# Altium schematic sheet Sig_Acq.SchDoc
size 457 x 254 mm; SPICEModelCacheCRLRCMOW: <root> / <DocumentId>CRLRCMOW</DocumentId> / <CacheFrame Number="0"> / <Model Name="cap" Kind="MDL"> / <Text>*Default semiconductor capacitor / .MODEL CAP C()</Text> / </Model> / </CacheFrame> / </root>
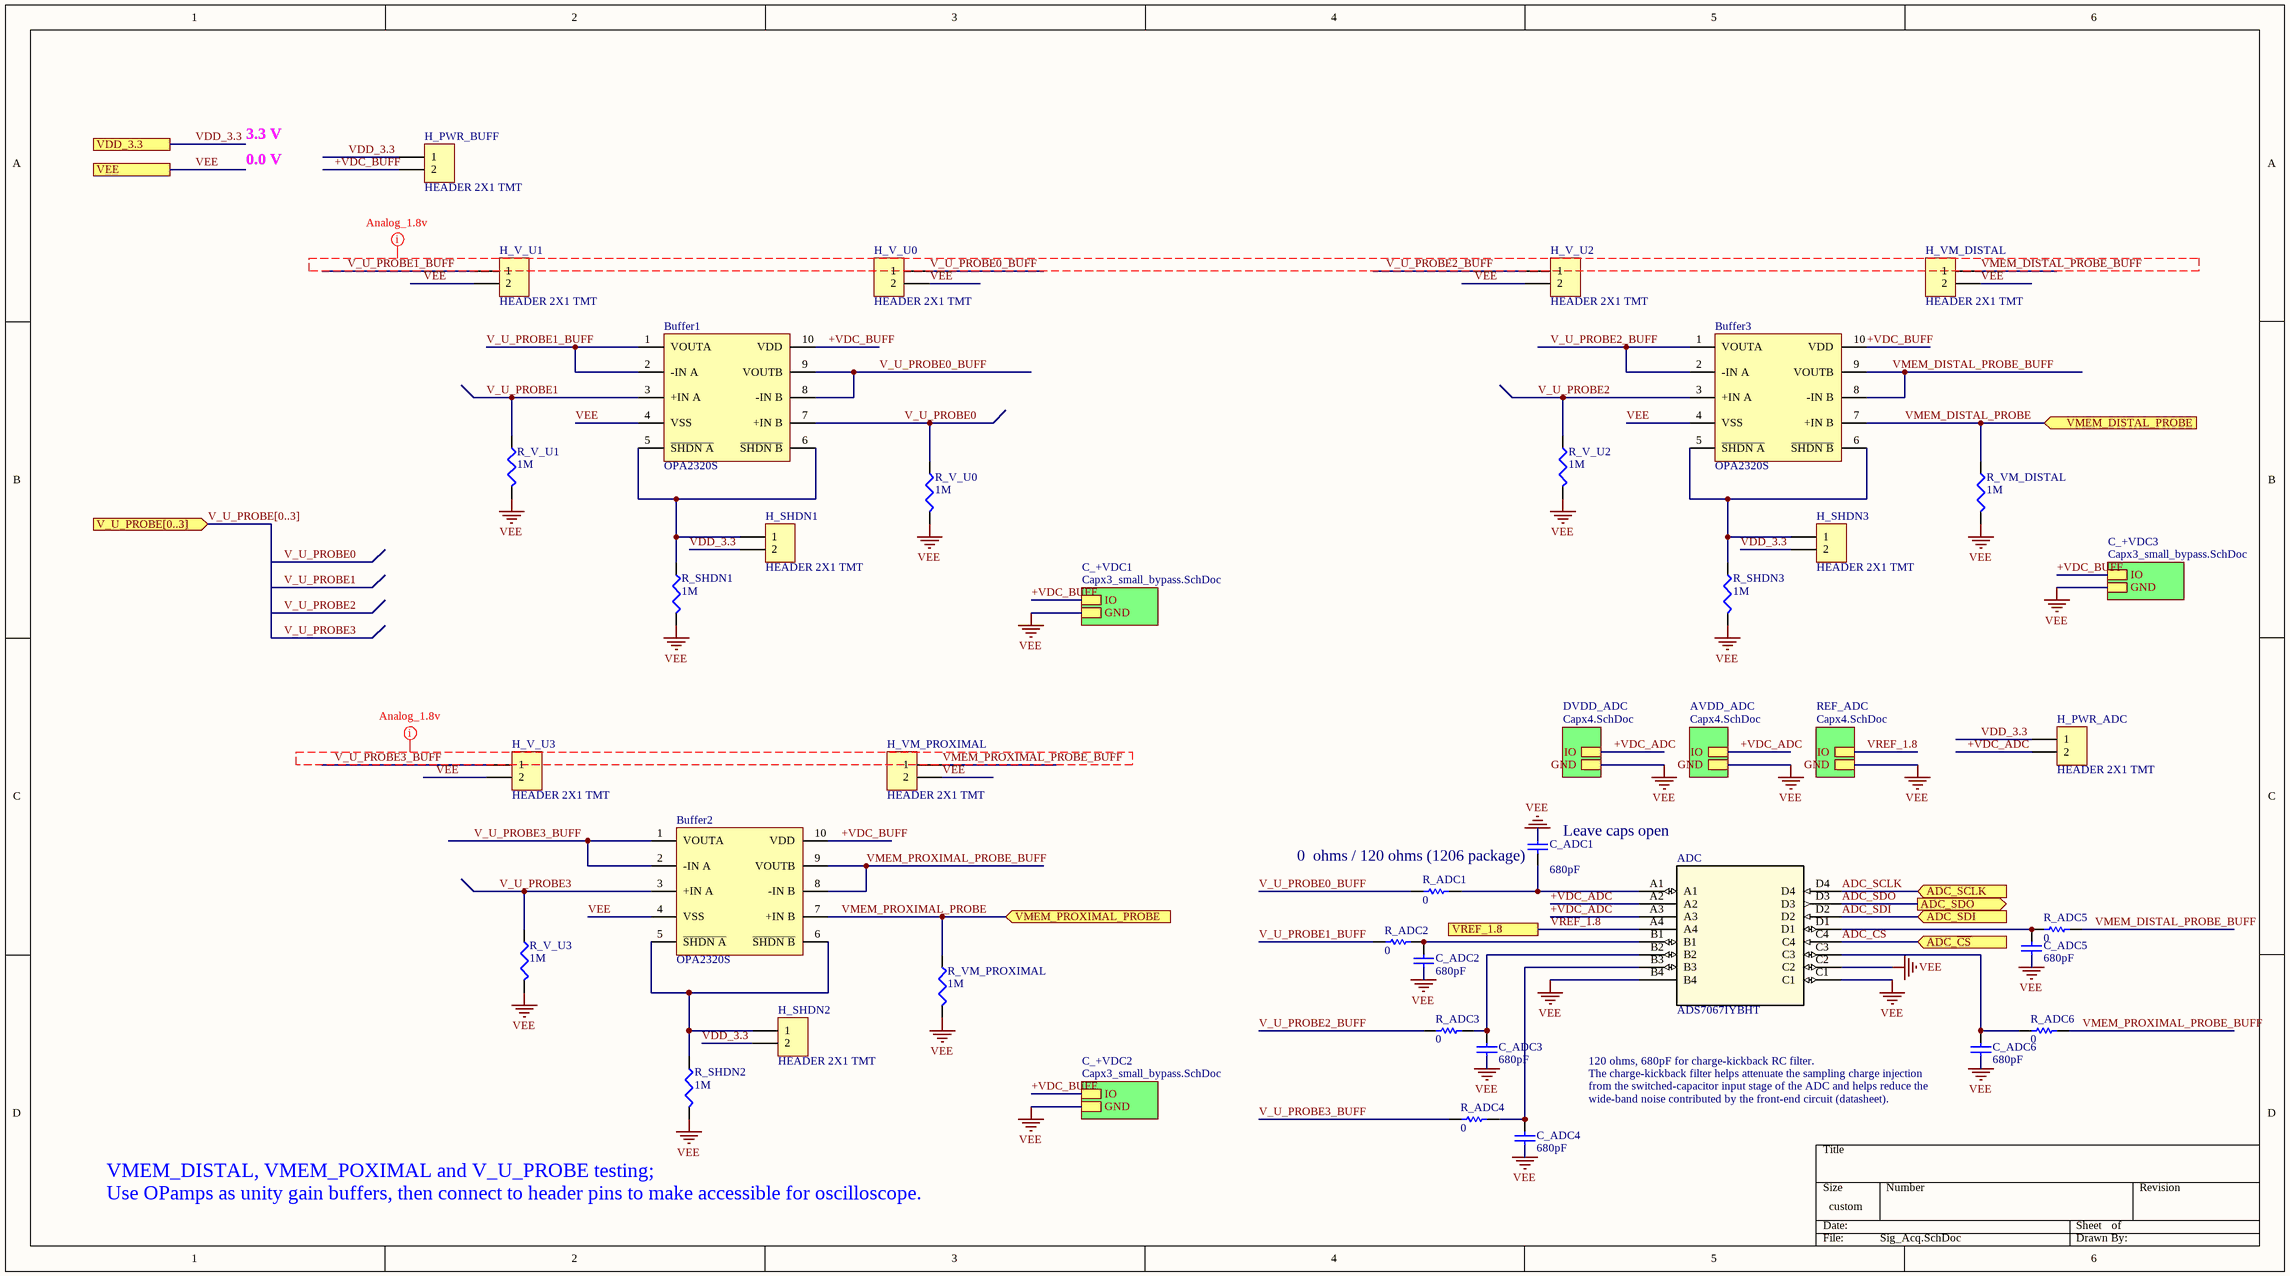
[diagram p0: Sig_Acq.SchDoc]

## Parts
ADC  ADS7067IYBHT  [BGA16_YBH_TEX]
Buffer1  OPA2320S  [TI OPA2320SAIDGSR]
Buffer2  OPA2320S  [TI OPA2320SAIDGSR]
Buffer3  OPA2320S  [TI OPA2320SAIDGSR]
C_ADC1  value 680pF  [THERM_NCP18XH103F03RB]  (hidden comment: Cap)
C_ADC2  value 680pF  [THERM_NCP18XH103F03RB]  (hidden comment: Cap)
C_ADC3  value 680pF  [THERM_NCP18XH103F03RB]  (hidden comment: Cap)
C_ADC4  value 680pF  [THERM_NCP18XH103F03RB]  (hidden comment: Cap)
C_ADC5  value 680pF  [THERM_NCP18XH103F03RB]  (hidden comment: Cap)
C_ADC6  value 680pF  [THERM_NCP18XH103F03RB]  (hidden comment: Cap)
H_PWR_ADC  HEADER 2X1 TMT  [Samtec TSW-102-07-G-S]
H_PWR_BUFF  HEADER 2X1 TMT  [Samtec TSW-102-07-G-S]
H_SHDN1  HEADER 2X1 TMT  [Samtec TSW-102-07-G-S]
H_SHDN2  HEADER 2X1 TMT  [Samtec TSW-102-07-G-S]
H_SHDN3  HEADER 2X1 TMT  [Samtec TSW-102-07-G-S]
H_V_U0  HEADER 2X1 TMT  [Samtec TSW-102-07-G-S]
H_V_U1  HEADER 2X1 TMT  [Samtec TSW-102-07-G-S]
H_V_U2  HEADER 2X1 TMT  [Samtec TSW-102-07-G-S]
H_V_U3  HEADER 2X1 TMT  [Samtec TSW-102-07-G-S]
H_VM_DISTAL  HEADER 2X1 TMT  [Samtec TSW-102-07-G-S]
H_VM_PROXIMAL  HEADER 2X1 TMT  [Samtec TSW-102-07-G-S]
R_ADC1  0  [RESC3216X70X50NL05T20]
R_ADC2  0  [RESC3216X70X50NL05T20]
R_ADC3  0  [RESC3216X70X50NL05T20]
R_ADC4  0  [RESC3216X70X50NL05T20]
R_ADC5  0  [RESC3216X70X50NL05T20]
R_ADC6  0  [RESC3216X70X50NL05T20]
R_SHDN1  value 1M  [Panasonic ERA-6A Series Resistor]  (hidden comment: Res 1M 0.1% 0805)
R_SHDN2  value 1M  [Panasonic ERA-6A Series Resistor]  (hidden comment: Res 1M 0.1% 0805)
R_SHDN3  value 1M  [Panasonic ERA-6A Series Resistor]  (hidden comment: Res 1M 0.1% 0805)
R_V_U0  value 1M  [Panasonic ERA-6A Series Resistor]  (hidden comment: Res 1M 0.1% 0805)
R_V_U1  value 1M  [Panasonic ERA-6A Series Resistor]  (hidden comment: Res 1M 0.1% 0805)
R_V_U2  value 1M  [Panasonic ERA-6A Series Resistor]  (hidden comment: Res 1M 0.1% 0805)
R_V_U3  value 1M  [Panasonic ERA-6A Series Resistor]  (hidden comment: Res 1M 0.1% 0805)
R_VM_DISTAL  value 1M  [Panasonic ERA-6A Series Resistor]  (hidden comment: Res 1M 0.1% 0805)
R_VM_PROXIMAL  value 1M  [Panasonic ERA-6A Series Resistor]  (hidden comment: Res 1M 0.1% 0805)

## Sub-sheets
AVDD_ADC = Capx4.SchDoc: IO, GND
C_+VDC1 = Capx3_small_bypass.SchDoc: IO, GND
C_+VDC2 = Capx3_small_bypass.SchDoc: IO, GND
C_+VDC3 = Capx3_small_bypass.SchDoc: IO, GND
DVDD_ADC = Capx4.SchDoc: IO, GND
REF_ADC = Capx4.SchDoc: IO, GND

## Ports
ADC_SCLK (in), ADC_SDI (in), ADC_SDO (out), ADC_~{CS} (in), V_U_PROBE[0..3] (in), VDD_3.3, VEE, VMEM_DISTAL_PROBE (in), VMEM_PROXIMAL_PROBE (in), VREF_1.8

## Nets
VEE: ADC.B4 ADC.C1 ADC.C2 Buffer1.4(VSS) Buffer2.4(VSS) Buffer3.4(VSS) C_ADC1.2 C_ADC2.2 C_ADC3.2 C_ADC4.2 C_ADC5.2 C_ADC6.2 H_V_U0.2 H_V_U1.2 H_V_U2.2 H_V_U3.2 H_VM_DISTAL.2 H_VM_PROXIMAL.2 R_SHDN1.2 R_SHDN2.2 R_SHDN3.2 R_V_U0.2 R_V_U1.2 R_V_U2.2 R_V_U3.2 R_VM_DISTAL.2 R_VM_PROXIMAL.2 ; port VEE, sheet C_+VDC3/GND, sheet C_+VDC2/GND, sheet C_+VDC1/GND, sheet DVDD_ADC/GND, sheet REF_ADC/GND, sheet AVDD_ADC/GND
+VDC_ADC: ADC.A2 ADC.A3 H_PWR_ADC.2 ; sheet DVDD_ADC/IO, sheet AVDD_ADC/IO
+VDC_BUFF: Buffer1.10(VDD) Buffer2.10(VDD) Buffer3.10(VDD) H_PWR_BUFF.2 ; sheet C_+VDC3/IO, sheet C_+VDC2/IO, sheet C_+VDC1/IO
ADC_~{CS}: ADC.C4 ; port ADC_~{CS}
ADC_SCLK: ADC.D4 ; port ADC_SCLK
ADC_SDI: ADC.D2 ; port ADC_SDI
ADC_SDO: ADC.D3 ; port ADC_SDO
V_U_PROBE0: Buffer1.7(+IN_B) R_V_U0.1
V_U_PROBE0_BUFF: Buffer1.8(-IN_B) Buffer1.9(VOUTB) H_V_U0.1 R_ADC1.1
V_U_PROBE1: Buffer1.3(+IN_A) R_V_U1.1
V_U_PROBE1_BUFF: Buffer1.1(VOUTA) Buffer1.2(-IN_A) H_V_U1.1 R_ADC2.1
V_U_PROBE2: Buffer3.3(+IN_A) R_V_U2.1
V_U_PROBE2_BUFF: Buffer3.1(VOUTA) Buffer3.2(-IN_A) H_V_U2.1 R_ADC3.1
V_U_PROBE3: Buffer2.3(+IN_A) R_V_U3.1
V_U_PROBE3_BUFF: Buffer2.1(VOUTA) Buffer2.2(-IN_A) H_V_U3.1 R_ADC4.1
VDD_3.3: H_PWR_ADC.1 H_PWR_BUFF.1 H_SHDN1.2 H_SHDN2.2 H_SHDN3.2 ; port VDD_3.3
VMEM_DISTAL_PROBE: Buffer3.7(+IN_B) R_VM_DISTAL.1 ; port VMEM_DISTAL_PROBE
VMEM_DISTAL_PROBE_BUFF: Buffer3.8(-IN_B) Buffer3.9(VOUTB) H_VM_DISTAL.1 R_ADC5.2
VMEM_PROXIMAL_PROBE: Buffer2.7(+IN_B) R_VM_PROXIMAL.1 ; port VMEM_PROXIMAL_PROBE
VMEM_PROXIMAL_PROBE_BUFF: Buffer2.8(-IN_B) Buffer2.9(VOUTB) H_VM_PROXIMAL.1 R_ADC6.2
VREF_1.8: ADC.A4 ; port VREF_1.8, sheet REF_ADC/IO
NetADC_A1: ADC.A1 C_ADC1.1 R_ADC1.2
NetADC_B1: ADC.B1 C_ADC2.1 R_ADC2.2
NetADC_B2: ADC.B2 C_ADC3.1 R_ADC3.2
NetADC_B3: ADC.B3 C_ADC4.1 R_ADC4.2
NetADC_C3: ADC.C3 C_ADC6.1 R_ADC6.1
NetADC_D1: ADC.D1 C_ADC5.1 R_ADC5.1
NetBuffer1_5: Buffer1.5(~{SHDN_A}) Buffer1.6(~{SHDN_B}) H_SHDN1.1 R_SHDN1.1
NetBuffer2_5: Buffer2.5(~{SHDN_A}) Buffer2.6(~{SHDN_B}) H_SHDN2.1 R_SHDN2.1
NetBuffer3_5: Buffer3.5(~{SHDN_A}) Buffer3.6(~{SHDN_B}) H_SHDN3.1 R_SHDN3.1

## Buses and harness runs
bus V_U_PROBE[0..3] = port V_U_PROBE[0..3]

## Layout directives
net class Analog: V_U_PROBE0_BUFF, V_U_PROBE1_BUFF, V_U_PROBE2_BUFF, V_U_PROBE3_BUFF, VMEM_DISTAL_PROBE_BUFF, VMEM_PROXIMAL_PROBE_BUFF

## Notes on the sheet
- 3.3 V
- 0.0 V
- (near C_ADC1) Leave caps open
- (near C_ADC1) 0  ohms / 120 ohms (1206 package)
- 120 ohms, 680pF for charge-kickback RC filter.
- (near C_ADC6) The charge-kickback filter helps attenuate the sampling charge injection
- (near C_ADC6) from the switched-capacitor input stage of the ADC and helps reduce the
- wide-band noise contributed by the front-end circuit (datasheet).
- VMEM_DISTAL, VMEM_POXIMAL and V_U_PROBE testing;
  Use OPamps as unity gain buffers, then connect to header pins to make accessible for oscilloscope.

## Library data of the parts
ADC = ADS7067IYBHT: No Description Available; Mfr_Name: Texas Instruments; Copyright: Copyright (C) 2022 Ultra Librarian. All rights reserved.; Manufacturer_Part_Number: ADS7067IYBHT; RefDes: RefDes; Type: DEV
Buffer1-Buffer3 = OPA2320S: IC OPAMP RR CMOS 20MHZ 10VSSOP / CMOS Amplifier Circuit Rail-to-Rail 10-VSSOP; Supplier 1: Digi-Key; Supplier 2: Digi-Key; Supplier 3: Mouser; Supplier Part Number 1: 296-40455-1-ND; Supplier Part Number 2: 296-48160-1-ND; Supplier Part Number 3: 595-OPA2320SAIDGSR
C_ADC1-C_ADC6 = Cap: Capacitor; Published: 8-Jun-2000; LatestRevisionDate: 17-Jul-2002; LatestRevisionNote: Re-released for DXP Platform.; PackageReference: RAD-0.3; Publisher: Altium Limited; PackageDescription: Radial Cap, Thru-Hole; 2 Leads; 0.3 in Pin Spacing; Supplier 1: Mouser; Supplier Part Number 1: 81-GCM1885C1H681FAD
H_PWR_ADC H_PWR_BUFF H_SHDN1-H_SHDN3 H_V_U0-H_V_U3 H_VM_DISTAL H_VM_PROXIMAL = HEADER 2X1 TMT: CONN HEADER VERT 2POS 2.54MM / Connector Header Through Hole 2 position 0.100" (2.54mm); Supplier 1: Digi-Key; Supplier Part Number 1: SAM1029-02-ND
R_ADC1-R_ADC6 = CMP-2003-00541-1: Manufacturer: Panasonic; Part Number: ERJ-8GEY0R00V
R_SHDN1-R_SHDN3 R_V_U0-R_V_U3 R_VM_DISTAL R_VM_PROXIMAL = Res 1M 0.1% 0805: RES 1M OHM 0.1% 1/8W 0805 / 1 ±0.1% 0.125W, 1/8W Chip Resistor 0805 (2012 Metric) Automotive AEC-Q200 Thin Film; Supplier 1: Digi-Key; Supplier Part Number 1: P1MDACT-ND; Supplier 2: Digi-Key; Supplier Part Number 2: YAG1821CT-ND